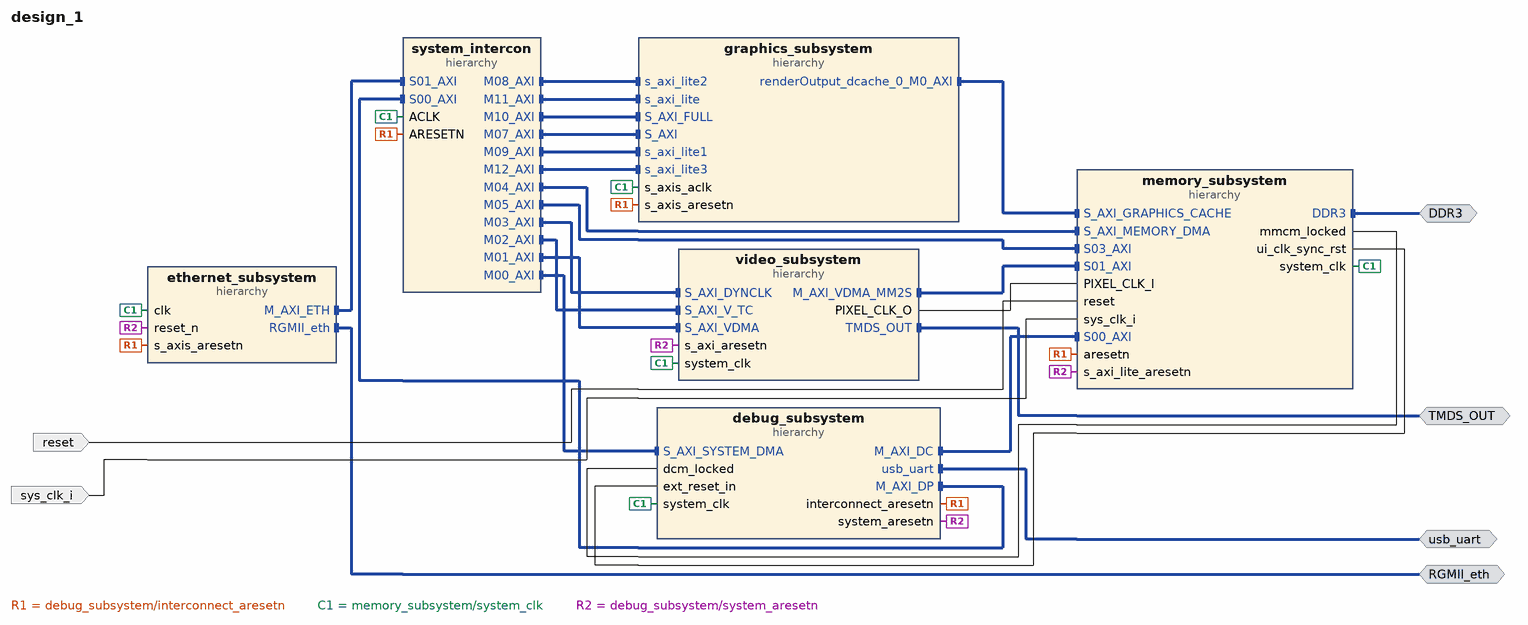
[diagram p0: block diagram of the top level]
# Vivado block design design_1, xc7a200tsbg484-1, Vivado 2020.1
create_bd_design design_1

create_bd_intf_port -mode Master -vlnv xilinx.com:interface:ddrx_rtl:1.0 DDR3
create_bd_intf_port -mode Master -vlnv xilinx.com:interface:eth_rtl:1.0 RGMII_eth
create_bd_intf_port -mode Master -vlnv digilentinc.com:interface:tmds_rtl:1.0 TMDS_OUT
create_bd_intf_port -mode Master -vlnv xilinx.com:interface:uart_rtl:1.0 usb_uart
create_bd_port -dir I -type rst reset
create_bd_port -dir I -type clk sys_clk_i
set_property -dict {CONFIG.FREQ_HZ 100000000} [get_bd_ports sys_clk_i]

create_bd_cell -type hier debug_subsystem
create_bd_cell -type hier ethernet_subsystem
create_bd_cell -type hier graphics_subsystem
create_bd_cell -type hier memory_subsystem
create_bd_cell -type hier system_intercon
create_bd_cell -type hier video_subsystem

# ---- hierarchy /debug_subsystem ----
current_bd_instance /debug_subsystem
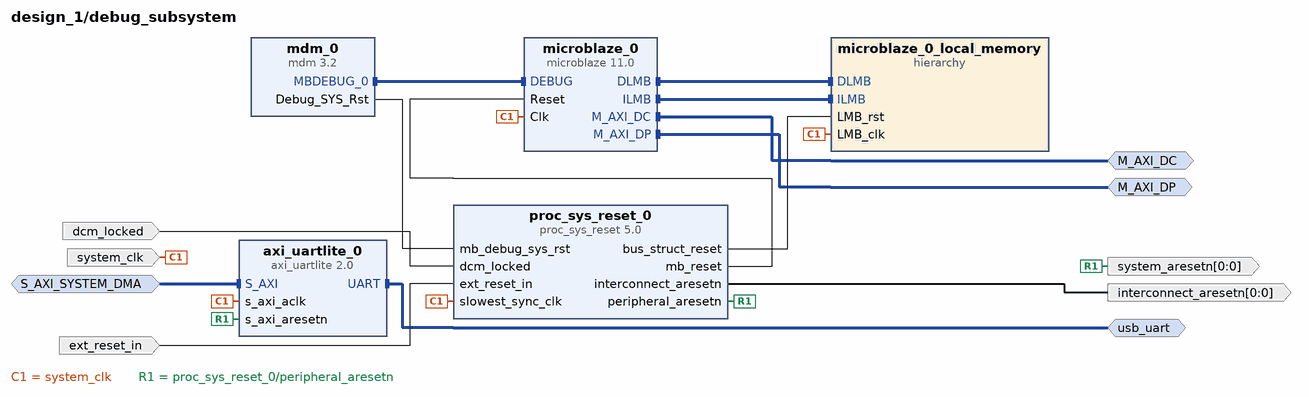
[diagram p1: block diagram inside /debug_subsystem]
create_bd_intf_pin -mode Master -vlnv xilinx.com:interface:aximm_rtl:1.0 M_AXI_DC
create_bd_intf_pin -mode Master -vlnv xilinx.com:interface:aximm_rtl:1.0 M_AXI_DP
create_bd_intf_pin -mode Slave -vlnv xilinx.com:interface:aximm_rtl:1.0 S_AXI_SYSTEM_DMA
create_bd_intf_pin -mode Master -vlnv xilinx.com:interface:uart_rtl:1.0 usb_uart
create_bd_pin -dir I dcm_locked
create_bd_pin -dir I -type rst ext_reset_in
create_bd_pin -dir O -from 0 -to 0 -type rst interconnect_aresetn
create_bd_pin -dir O -from 0 -to 0 -type rst system_aresetn
create_bd_pin -dir I -type clk system_clk

create_bd_cell -type ip -vlnv xilinx.com:ip:axi_uartlite:2.0 axi_uartlite_0
set_property -dict [list \
  CONFIG.C_BAUDRATE 115200 \
  CONFIG.UARTLITE_BOARD_INTERFACE usb_uart \
  CONFIG.USE_BOARD_FLOW true \
] [get_bd_cells axi_uartlite_0]
create_bd_cell -type ip -vlnv xilinx.com:ip:mdm:3.2 mdm_0
create_bd_cell -type ip -vlnv xilinx.com:ip:microblaze:11.0 microblaze_0
set_property -dict [list \
  CONFIG.C_ADDR_TAG_BITS 0 \
  CONFIG.C_DCACHE_ADDR_TAG 16 \
  CONFIG.C_DCACHE_ALWAYS_USED 1 \
  CONFIG.C_DCACHE_BASEADDR 0x0000000080000000 \
  CONFIG.C_DCACHE_DATA_WIDTH 1 \
  CONFIG.C_DCACHE_HIGHADDR 0x000000009FFFFFFF \
  CONFIG.C_DCACHE_USE_WRITEBACK 1 \
  CONFIG.C_DCACHE_VICTIMS 8 \
  CONFIG.C_D_AXI 1 \
  CONFIG.C_FSL_LINKS 1 \
  CONFIG.C_USE_DCACHE 1 \
  CONFIG.C_USE_EXTENDED_FSL_INSTR 1 \
  CONFIG.C_USE_ICACHE 0 \
  CONFIG.C_USE_MSR_INSTR 1 \
  CONFIG.C_USE_REORDER_INSTR 0 \
] [get_bd_cells microblaze_0]
create_bd_cell -type hier microblaze_0_local_memory
create_bd_cell -type ip -vlnv xilinx.com:ip:proc_sys_reset:5.0 proc_sys_reset_0

# ---- hierarchy /debug_subsystem/microblaze_0_local_memory ----
current_bd_instance /debug_subsystem/microblaze_0_local_memory
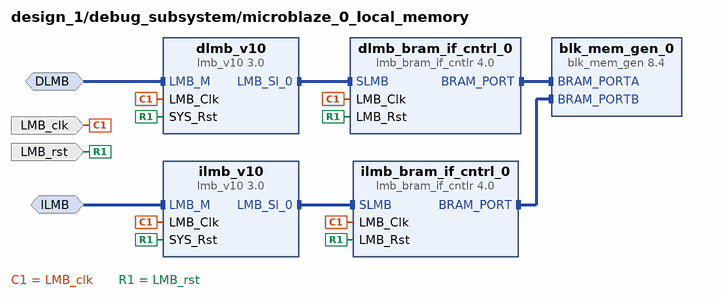
[diagram p2: block diagram inside /debug_subsystem/microblaze_0_local_memory]
create_bd_intf_pin -mode MirroredMaster -vlnv xilinx.com:interface:lmb_rtl:1.0 DLMB
create_bd_intf_pin -mode MirroredMaster -vlnv xilinx.com:interface:lmb_rtl:1.0 ILMB
create_bd_pin -dir I -type clk LMB_clk
create_bd_pin -dir I -type rst LMB_rst

create_bd_cell -type ip -vlnv xilinx.com:ip:blk_mem_gen:8.4 blk_mem_gen_0
set_property -dict [list \
  CONFIG.Assume_Synchronous_Clk false \
  CONFIG.EN_SAFETY_CKT false \
  CONFIG.Enable_32bit_Address true \
  CONFIG.Enable_B Use_ENB_Pin \
  CONFIG.Memory_Type True_Dual_Port_RAM \
  CONFIG.Port_B_Clock 100 \
  CONFIG.Port_B_Enable_Rate 100 \
  CONFIG.Port_B_Write_Rate 50 \
  CONFIG.Register_PortA_Output_of_Memory_Primitives false \
  CONFIG.Register_PortB_Output_of_Memory_Primitives false \
  CONFIG.Use_RSTA_Pin true \
  CONFIG.Use_RSTB_Pin true \
  CONFIG.use_bram_block BRAM_Controller \
] [get_bd_cells blk_mem_gen_0]
create_bd_cell -type ip -vlnv xilinx.com:ip:lmb_bram_if_cntlr:4.0 dlmb_bram_if_cntrl_0
create_bd_cell -type ip -vlnv xilinx.com:ip:lmb_v10:3.0 dlmb_v10
create_bd_cell -type ip -vlnv xilinx.com:ip:lmb_bram_if_cntlr:4.0 ilmb_bram_if_cntrl_0
create_bd_cell -type ip -vlnv xilinx.com:ip:lmb_v10:3.0 ilmb_v10

# ---- hierarchy /ethernet_subsystem ----
current_bd_instance /ethernet_subsystem
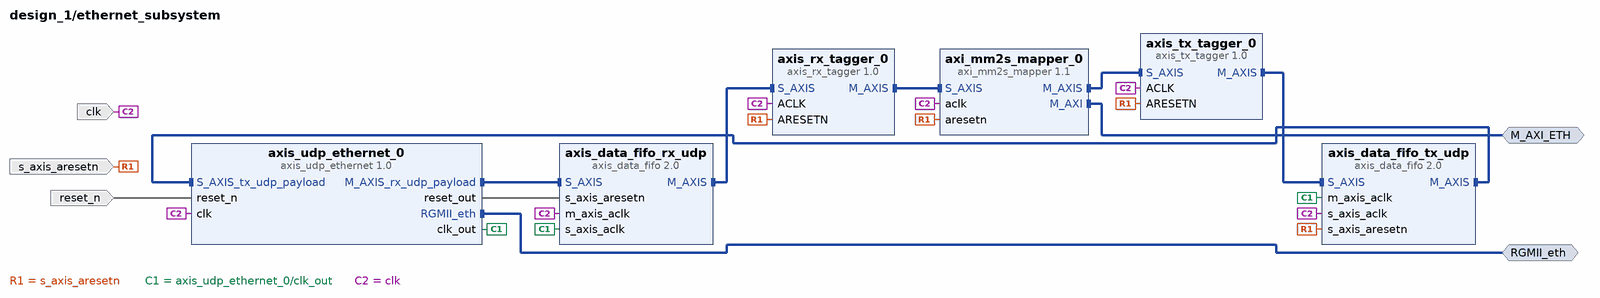
[diagram p3: block diagram inside /ethernet_subsystem]
create_bd_intf_pin -mode Master -vlnv xilinx.com:interface:aximm_rtl:1.0 M_AXI_ETH
create_bd_intf_pin -mode Master -vlnv xilinx.com:interface:eth_rtl:1.0 RGMII_eth
create_bd_pin -dir I -type clk clk
create_bd_pin -dir I -type rst reset_n
create_bd_pin -dir I -type rst s_axis_aresetn

create_bd_cell -type ip -vlnv xilinx.com:ip:axi_mm2s_mapper:1.1 axi_mm2s_mapper_0
set_property -dict {CONFIG.INTERFACES M_AXI} [get_bd_cells axi_mm2s_mapper_0]
create_bd_cell -type ip -vlnv xilinx.com:ip:axis_data_fifo:2.0 axis_data_fifo_rx_udp
set_property -dict {CONFIG.FIFO_DEPTH 2048 CONFIG.IS_ACLK_ASYNC 1} [get_bd_cells axis_data_fifo_rx_udp]
create_bd_cell -type ip -vlnv xilinx.com:ip:axis_data_fifo:2.0 axis_data_fifo_tx_udp
set_property -dict {CONFIG.FIFO_DEPTH 2048 CONFIG.IS_ACLK_ASYNC 1} [get_bd_cells axis_data_fifo_tx_udp]
create_bd_cell -type ip -vlnv xilinx.com:user:axis_rx_tagger:1.0 axis_rx_tagger_0
create_bd_cell -type ip -vlnv xilinx.com:user:axis_tx_tagger:1.0 axis_tx_tagger_0
create_bd_cell -type ip -vlnv xilinx.com:ip:axis_udp_ethernet:1.0 axis_udp_ethernet_0

# ---- hierarchy /graphics_subsystem ----
current_bd_instance /graphics_subsystem
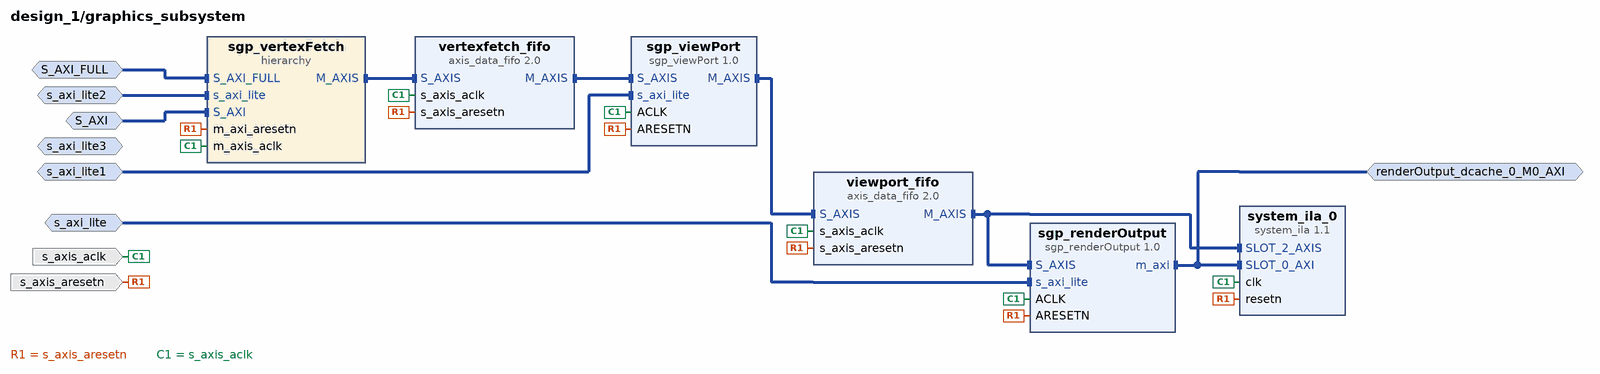
[diagram p4: block diagram inside /graphics_subsystem]
create_bd_intf_pin -mode Slave -vlnv xilinx.com:interface:aximm_rtl:1.0 S_AXI
create_bd_intf_pin -mode Slave -vlnv xilinx.com:interface:aximm_rtl:1.0 S_AXI_FULL
create_bd_intf_pin -mode Master -vlnv xilinx.com:interface:aximm_rtl:1.0 renderOutput_dcache_0_M0_AXI
create_bd_intf_pin -mode Slave -vlnv xilinx.com:interface:aximm_rtl:1.0 s_axi_lite
create_bd_intf_pin -mode Slave -vlnv xilinx.com:interface:aximm_rtl:1.0 s_axi_lite1
create_bd_intf_pin -mode Slave -vlnv xilinx.com:interface:aximm_rtl:1.0 s_axi_lite2
create_bd_intf_pin -mode Slave -vlnv xilinx.com:interface:aximm_rtl:1.0 s_axi_lite3
create_bd_pin -dir I -type clk s_axis_aclk
create_bd_pin -dir I -type rst s_axis_aresetn

create_bd_cell -type ip -vlnv xilinx.com:user:sgp_renderOutput:1.0 sgp_renderOutput
set_property -dict {CONFIG.C_M_AXI_ID_WIDTH 4} [get_bd_cells sgp_renderOutput]
create_bd_cell -type hier sgp_vertexFetch
create_bd_cell -type ip -vlnv xilinx.com:user:sgp_viewPort:1.0 sgp_viewPort
create_bd_cell -type ip -vlnv xilinx.com:ip:system_ila:1.1 system_ila_0
set_property -dict [list \
  CONFIG.C_NUM_MONITOR_SLOTS 3 \
  CONFIG.C_SLOT 2 \
  CONFIG.C_SLOT_1_INTF_TYPE xilinx.com:interface:axis_rtl:1.0 \
  CONFIG.C_SLOT_2_INTF_TYPE xilinx.com:interface:axis_rtl:1.0 \
] [get_bd_cells system_ila_0]
create_bd_cell -type ip -vlnv xilinx.com:ip:axis_data_fifo:2.0 vertexfetch_fifo
set_property -dict {CONFIG.FIFO_DEPTH 16} [get_bd_cells vertexfetch_fifo]
create_bd_cell -type ip -vlnv xilinx.com:ip:axis_data_fifo:2.0 viewport_fifo

# ---- hierarchy /graphics_subsystem/sgp_vertexFetch ----
current_bd_instance /graphics_subsystem/sgp_vertexFetch
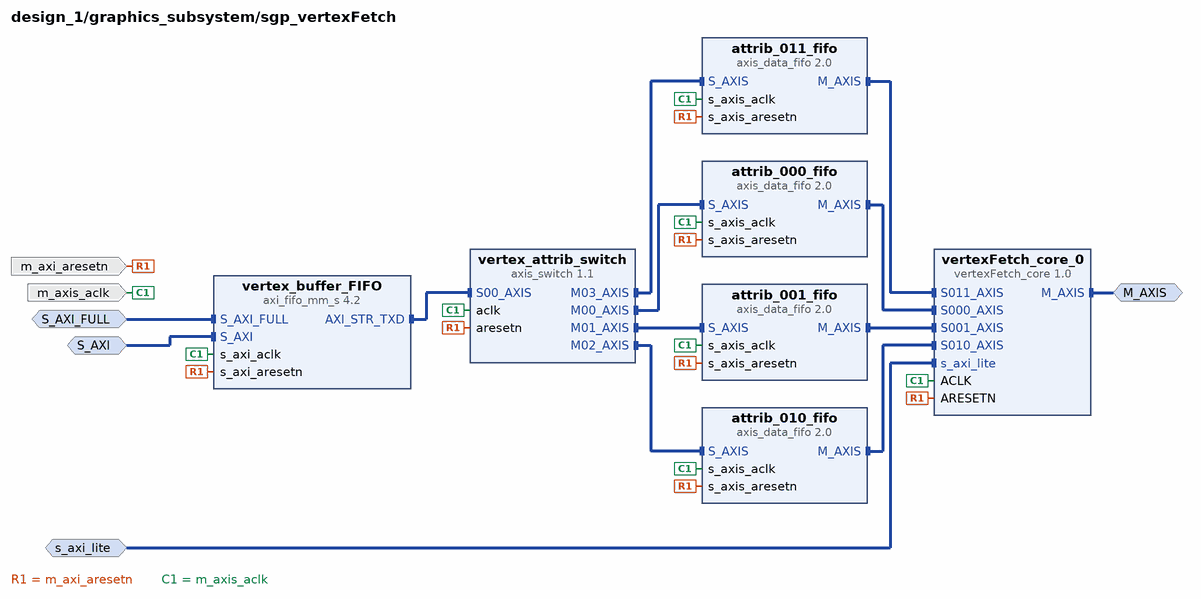
[diagram p5: block diagram inside /graphics_subsystem/sgp_vertexFetch]
create_bd_intf_pin -mode Master -vlnv xilinx.com:interface:axis_rtl:1.0 M_AXIS
create_bd_intf_pin -mode Slave -vlnv xilinx.com:interface:aximm_rtl:1.0 S_AXI
create_bd_intf_pin -mode Slave -vlnv xilinx.com:interface:aximm_rtl:1.0 S_AXI_FULL
create_bd_intf_pin -mode Slave -vlnv xilinx.com:interface:aximm_rtl:1.0 s_axi_lite
create_bd_pin -dir I -type rst m_axi_aresetn
create_bd_pin -dir I -type clk m_axis_aclk

create_bd_cell -type ip -vlnv xilinx.com:ip:axis_data_fifo:2.0 attrib_000_fifo
set_property -dict {CONFIG.FIFO_DEPTH 1024} [get_bd_cells attrib_000_fifo]
create_bd_cell -type ip -vlnv xilinx.com:ip:axis_data_fifo:2.0 attrib_001_fifo
set_property -dict {CONFIG.FIFO_DEPTH 1024} [get_bd_cells attrib_001_fifo]
create_bd_cell -type ip -vlnv xilinx.com:ip:axis_data_fifo:2.0 attrib_010_fifo
set_property -dict {CONFIG.FIFO_DEPTH 1024} [get_bd_cells attrib_010_fifo]
create_bd_cell -type ip -vlnv xilinx.com:ip:axis_data_fifo:2.0 attrib_011_fifo
set_property -dict {CONFIG.FIFO_DEPTH 1024} [get_bd_cells attrib_011_fifo]
create_bd_cell -type ip -vlnv xilinx.com:user:vertexFetch_core:1.0 vertexFetch_core_0
create_bd_cell -type ip -vlnv xilinx.com:ip:axis_switch:1.1 vertex_attrib_switch
set_property -dict [list \
  CONFIG.DECODER_REG 1 \
  CONFIG.NUM_MI 4 \
  CONFIG.NUM_SI 1 \
  CONFIG.ROUTING_MODE 0 \
] [get_bd_cells vertex_attrib_switch]
create_bd_cell -type ip -vlnv xilinx.com:ip:axi_fifo_mm_s:4.2 vertex_buffer_FIFO
set_property -dict [list \
  CONFIG.C_DATA_INTERFACE_TYPE 1 \
  CONFIG.C_HAS_AXIS_TDEST true \
  CONFIG.C_TX_FIFO_DEPTH 4096 \
  CONFIG.C_TX_FIFO_PE_THRESHOLD 5 \
  CONFIG.C_TX_FIFO_PF_THRESHOLD 507 \
  CONFIG.C_USE_RX_DATA 0 \
  CONFIG.C_USE_TX_CTRL 0 \
] [get_bd_cells vertex_buffer_FIFO]

# ---- hierarchy /memory_subsystem ----
current_bd_instance /memory_subsystem
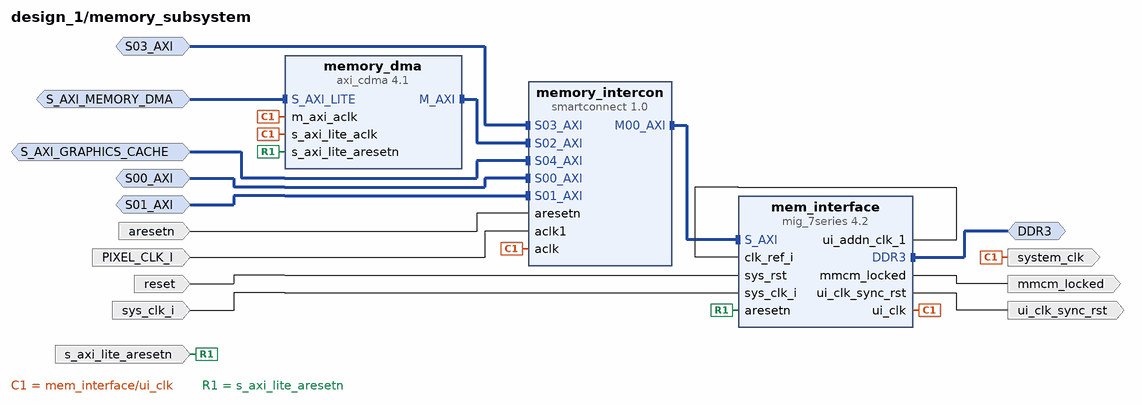
[diagram p6: block diagram inside /memory_subsystem]
create_bd_intf_pin -mode Master -vlnv xilinx.com:interface:ddrx_rtl:1.0 DDR3
create_bd_intf_pin -mode Slave -vlnv xilinx.com:interface:aximm_rtl:1.0 S00_AXI
create_bd_intf_pin -mode Slave -vlnv xilinx.com:interface:aximm_rtl:1.0 S01_AXI
create_bd_intf_pin -mode Slave -vlnv xilinx.com:interface:aximm_rtl:1.0 S03_AXI
create_bd_intf_pin -mode Slave -vlnv xilinx.com:interface:aximm_rtl:1.0 S_AXI_GRAPHICS_CACHE
create_bd_intf_pin -mode Slave -vlnv xilinx.com:interface:aximm_rtl:1.0 S_AXI_MEMORY_DMA
create_bd_pin -dir I -type clk PIXEL_CLK_I
create_bd_pin -dir I -type rst aresetn
create_bd_pin -dir O mmcm_locked
create_bd_pin -dir I -type rst reset
create_bd_pin -dir I -type rst s_axi_lite_aresetn
create_bd_pin -dir I -type clk sys_clk_i
create_bd_pin -dir O -type clk system_clk
create_bd_pin -dir O -type rst ui_clk_sync_rst

create_bd_cell -type ip -vlnv xilinx.com:ip:mig_7series:4.2 mem_interface
set_property -dict [list \
  CONFIG.BOARD_MIG_PARAM Custom \
  CONFIG.MIG_DONT_TOUCH_PARAM Custom \
  CONFIG.RESET_BOARD_INTERFACE Custom \
  CONFIG.XML_INPUT_FILE mig_b.prj \
] [get_bd_cells mem_interface]
create_bd_cell -type ip -vlnv xilinx.com:ip:axi_cdma:4.1 memory_dma
set_property -dict [list \
  CONFIG.C_INCLUDE_DRE 1 \
  CONFIG.C_INCLUDE_SF 1 \
  CONFIG.C_INCLUDE_SG 0 \
  CONFIG.C_M_AXI_DATA_WIDTH 32 \
  CONFIG.C_M_AXI_MAX_BURST_LEN 16 \
] [get_bd_cells memory_dma]
create_bd_cell -type ip -vlnv xilinx.com:ip:smartconnect:1.0 memory_intercon
set_property -dict [list \
  CONFIG.ADVANCED_PROPERTIES {  __view__ { clocking { S03_Entry { ASSOCIATED_CLK aclk } } } } \
  CONFIG.NUM_CLKS 2 \
  CONFIG.NUM_SI 5 \
] [get_bd_cells memory_intercon]

# ---- hierarchy /system_intercon ----
current_bd_instance /system_intercon
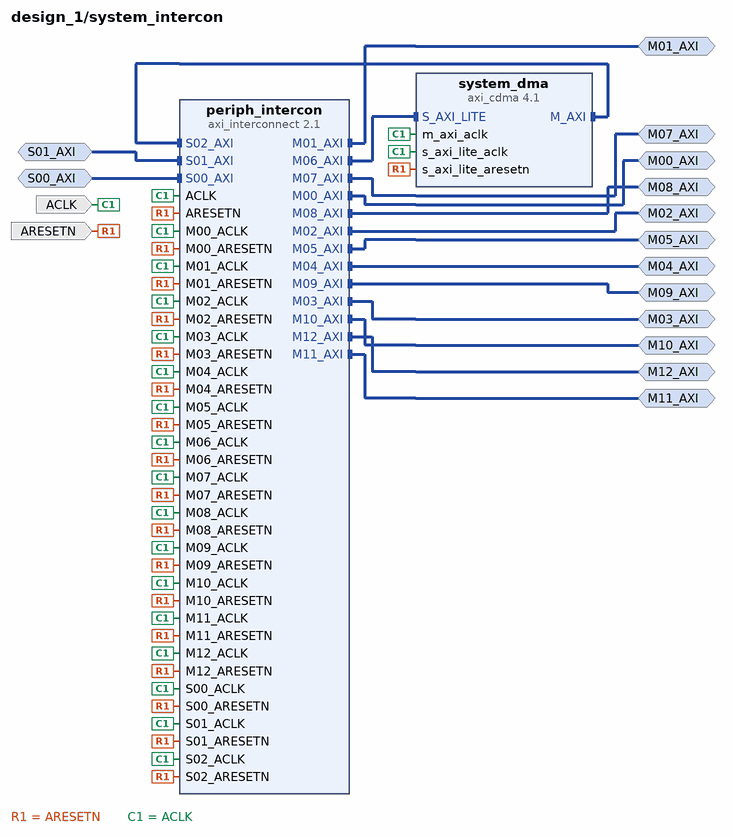
[diagram p7: block diagram inside /system_intercon]
create_bd_intf_pin -mode Master -vlnv xilinx.com:interface:aximm_rtl:1.0 M00_AXI
create_bd_intf_pin -mode Master -vlnv xilinx.com:interface:aximm_rtl:1.0 M01_AXI
create_bd_intf_pin -mode Master -vlnv xilinx.com:interface:aximm_rtl:1.0 M02_AXI
create_bd_intf_pin -mode Master -vlnv xilinx.com:interface:aximm_rtl:1.0 M03_AXI
create_bd_intf_pin -mode Master -vlnv xilinx.com:interface:aximm_rtl:1.0 M04_AXI
create_bd_intf_pin -mode Master -vlnv xilinx.com:interface:aximm_rtl:1.0 M05_AXI
create_bd_intf_pin -mode Master -vlnv xilinx.com:interface:aximm_rtl:1.0 M07_AXI
create_bd_intf_pin -mode Master -vlnv xilinx.com:interface:aximm_rtl:1.0 M08_AXI
create_bd_intf_pin -mode Master -vlnv xilinx.com:interface:aximm_rtl:1.0 M09_AXI
create_bd_intf_pin -mode Master -vlnv xilinx.com:interface:aximm_rtl:1.0 M10_AXI
create_bd_intf_pin -mode Master -vlnv xilinx.com:interface:aximm_rtl:1.0 M11_AXI
create_bd_intf_pin -mode Master -vlnv xilinx.com:interface:aximm_rtl:1.0 M12_AXI
create_bd_intf_pin -mode Slave -vlnv xilinx.com:interface:aximm_rtl:1.0 S00_AXI
create_bd_intf_pin -mode Slave -vlnv xilinx.com:interface:aximm_rtl:1.0 S01_AXI
create_bd_pin -dir I -type clk ACLK
create_bd_pin -dir I -type rst ARESETN

create_bd_cell -type ip -vlnv xilinx.com:ip:axi_interconnect:2.1 periph_intercon
set_property -dict {CONFIG.ENABLE_ADVANCED_OPTIONS 1 CONFIG.NUM_MI 13 CONFIG.NUM_SI 3} [get_bd_cells periph_intercon]
create_bd_cell -type ip -vlnv xilinx.com:ip:axi_cdma:4.1 system_dma
set_property -dict {CONFIG.C_INCLUDE_DRE 1 CONFIG.C_INCLUDE_SF 1 CONFIG.C_INCLUDE_SG 0} [get_bd_cells system_dma]

# ---- hierarchy /video_subsystem ----
current_bd_instance /video_subsystem
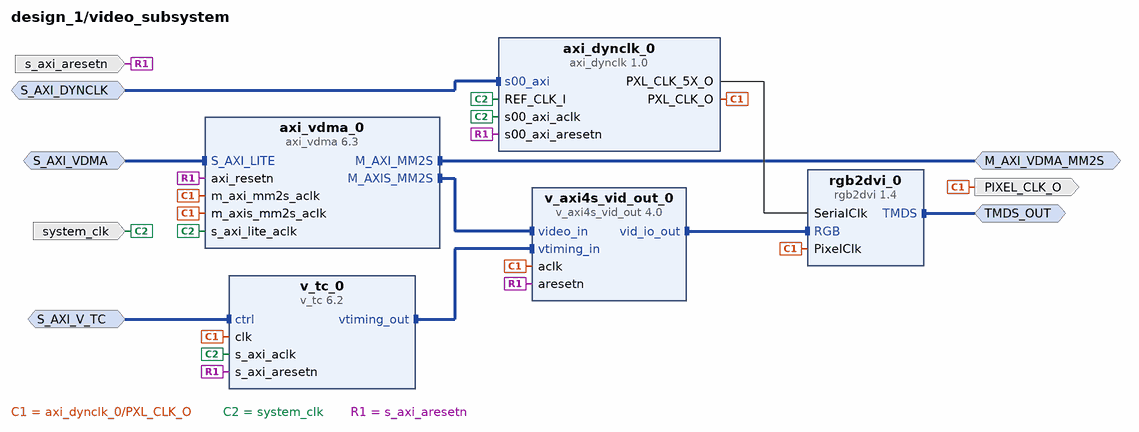
[diagram p8: block diagram inside /video_subsystem]
create_bd_intf_pin -mode Master -vlnv xilinx.com:interface:aximm_rtl:1.0 M_AXI_VDMA_MM2S
create_bd_intf_pin -mode Slave -vlnv xilinx.com:interface:aximm_rtl:1.0 S_AXI_DYNCLK
create_bd_intf_pin -mode Slave -vlnv xilinx.com:interface:aximm_rtl:1.0 S_AXI_VDMA
create_bd_intf_pin -mode Slave -vlnv xilinx.com:interface:aximm_rtl:1.0 S_AXI_V_TC
create_bd_intf_pin -mode Master -vlnv digilentinc.com:interface:tmds_rtl:1.0 TMDS_OUT
create_bd_pin -dir O -type clk PIXEL_CLK_O
create_bd_pin -dir I -type rst s_axi_aresetn
create_bd_pin -dir I -type clk system_clk

create_bd_cell -type ip -vlnv digilentinc.com:ip:axi_dynclk:1.0 axi_dynclk_0
set_property -dict {CONFIG.ADD_BUFMR true} [get_bd_cells axi_dynclk_0]
create_bd_cell -type ip -vlnv xilinx.com:ip:axi_vdma:6.3 axi_vdma_0
set_property -dict [list \
  CONFIG.c_include_s2mm 0 \
  CONFIG.c_m_axi_mm2s_data_width 128 \
  CONFIG.c_m_axis_mm2s_tdata_width 32 \
  CONFIG.c_mm2s_genlock_mode 0 \
  CONFIG.c_mm2s_linebuffer_depth 512 \
  CONFIG.c_mm2s_max_burst_length 32 \
] [get_bd_cells axi_vdma_0]
create_bd_cell -type ip -vlnv digilentinc.com:ip:rgb2dvi:1.4 rgb2dvi_0
set_property -dict {CONFIG.kGenerateSerialClk false CONFIG.kRstActiveHigh false} [get_bd_cells rgb2dvi_0]
create_bd_cell -type ip -vlnv xilinx.com:ip:v_axi4s_vid_out:4.0 v_axi4s_vid_out_0
set_property -dict [list \
  CONFIG.C_ADDR_WIDTH 5 \
  CONFIG.C_S_AXIS_VIDEO_DATA_WIDTH 8 \
  CONFIG.C_S_AXIS_VIDEO_FORMAT 6 \
  CONFIG.C_VTG_MASTER_SLAVE 1 \
] [get_bd_cells v_axi4s_vid_out_0]
create_bd_cell -type ip -vlnv xilinx.com:ip:v_tc:6.2 v_tc_0
set_property -dict {CONFIG.VIDEO_MODE 1080p CONFIG.enable_detection false} [get_bd_cells v_tc_0]

# ---- connections ----

current_bd_instance /debug_subsystem
connect_bd_intf_net [get_bd_intf_pins usb_uart] [get_bd_intf_pins axi_uartlite_0/UART]
connect_bd_intf_net [get_bd_intf_pins M_AXI_DC] [get_bd_intf_pins microblaze_0/M_AXI_DC]
connect_bd_intf_net [get_bd_intf_pins mdm_0/MBDEBUG_0] [get_bd_intf_pins microblaze_0/DEBUG]
connect_bd_intf_net [get_bd_intf_pins microblaze_0/DLMB] [get_bd_intf_pins microblaze_0_local_memory/DLMB]
connect_bd_intf_net [get_bd_intf_pins microblaze_0/ILMB] [get_bd_intf_pins microblaze_0_local_memory/ILMB]
connect_bd_intf_net -intf_net axi_interconnect_0_M00_AXI [get_bd_intf_pins S_AXI_SYSTEM_DMA] [get_bd_intf_pins axi_uartlite_0/S_AXI]
connect_bd_intf_net [get_bd_intf_pins M_AXI_DP] [get_bd_intf_pins microblaze_0/M_AXI_DP]
connect_bd_net -net ARESETN_1 [get_bd_pins proc_sys_reset_0/interconnect_aresetn] [get_bd_pins interconnect_aresetn]
connect_bd_net [get_bd_pins mdm_0/Debug_SYS_Rst] [get_bd_pins proc_sys_reset_0/mb_debug_sys_rst]
connect_bd_net -net mem_interface_mmcm_locked [get_bd_pins dcm_locked] [get_bd_pins proc_sys_reset_0/dcm_locked]
connect_bd_net -net mem_interface_ui_clk [get_bd_pins system_clk] \
  [get_bd_pins axi_uartlite_0/s_axi_aclk] [get_bd_pins microblaze_0/Clk] [get_bd_pins microblaze_0_local_memory/LMB_clk] \
  [get_bd_pins proc_sys_reset_0/slowest_sync_clk]
connect_bd_net -net mem_interface_ui_clk_sync_rst [get_bd_pins ext_reset_in] [get_bd_pins proc_sys_reset_0/ext_reset_in]
connect_bd_net [get_bd_pins proc_sys_reset_0/bus_struct_reset] [get_bd_pins microblaze_0_local_memory/LMB_rst]
connect_bd_net [get_bd_pins proc_sys_reset_0/mb_reset] [get_bd_pins microblaze_0/Reset]
connect_bd_net [get_bd_pins proc_sys_reset_0/peripheral_aresetn] [get_bd_pins system_aresetn] [get_bd_pins axi_uartlite_0/s_axi_aresetn]
set_property HDL_ATTRIBUTE.BMM_INFO_PROCESSOR {microblaze-le > design_1 debug_subsystem/microblaze_0_local_memory/dlmb_bram_if_cntrl_0} [get_bd_cells microblaze_0]
set_property HDL_ATTRIBUTE.KEEP_HIERARCHY yes [get_bd_cells microblaze_0]

current_bd_instance /debug_subsystem/microblaze_0_local_memory
connect_bd_intf_net -intf_net microblaze_0_DLMB [get_bd_intf_pins DLMB] [get_bd_intf_pins dlmb_v10/LMB_M]
connect_bd_intf_net [get_bd_intf_pins dlmb_bram_if_cntrl_0/SLMB] [get_bd_intf_pins dlmb_v10/LMB_Sl_0]
connect_bd_intf_net [get_bd_intf_pins ilmb_bram_if_cntrl_0/SLMB] [get_bd_intf_pins ilmb_v10/LMB_Sl_0]
connect_bd_intf_net -intf_net microblaze_0_ILMB [get_bd_intf_pins ILMB] [get_bd_intf_pins ilmb_v10/LMB_M]
connect_bd_intf_net [get_bd_intf_pins blk_mem_gen_0/BRAM_PORTA] [get_bd_intf_pins dlmb_bram_if_cntrl_0/BRAM_PORT]
connect_bd_intf_net [get_bd_intf_pins blk_mem_gen_0/BRAM_PORTB] [get_bd_intf_pins ilmb_bram_if_cntrl_0/BRAM_PORT]
connect_bd_net [get_bd_pins LMB_clk] \
  [get_bd_pins dlmb_bram_if_cntrl_0/LMB_Clk] [get_bd_pins dlmb_v10/LMB_Clk] [get_bd_pins ilmb_bram_if_cntrl_0/LMB_Clk] \
  [get_bd_pins ilmb_v10/LMB_Clk]
connect_bd_net [get_bd_pins LMB_rst] \
  [get_bd_pins dlmb_bram_if_cntrl_0/LMB_Rst] [get_bd_pins dlmb_v10/SYS_Rst] [get_bd_pins ilmb_bram_if_cntrl_0/LMB_Rst] \
  [get_bd_pins ilmb_v10/SYS_Rst]
set_property HDL_ATTRIBUTE.BMM_INFO_ADDRESS_SPACE {byte  0x00000000 32 > design_1 debug_subsystem/microblaze_0_local_memory/blk_mem_gen_0} [get_bd_cells dlmb_bram_if_cntrl_0]
set_property HDL_ATTRIBUTE.KEEP_HIERARCHY yes [get_bd_cells dlmb_bram_if_cntrl_0]

current_bd_instance /ethernet_subsystem
connect_bd_intf_net -intf_net axi_tagger_0_M_AXIS [get_bd_intf_pins axi_mm2s_mapper_0/S_AXIS] [get_bd_intf_pins axis_rx_tagger_0/M_AXIS]
connect_bd_intf_net [get_bd_intf_pins RGMII_eth] [get_bd_intf_pins axis_udp_ethernet_0/RGMII_eth]
connect_bd_intf_net [get_bd_intf_pins M_AXI_ETH] [get_bd_intf_pins axi_mm2s_mapper_0/M_AXI]
connect_bd_intf_net [get_bd_intf_pins axi_mm2s_mapper_0/M_AXIS] [get_bd_intf_pins axis_tx_tagger_0/S_AXIS]
connect_bd_intf_net [get_bd_intf_pins axis_data_fifo_rx_udp/S_AXIS] [get_bd_intf_pins axis_udp_ethernet_0/M_AXIS_rx_udp_payload]
connect_bd_intf_net -intf_net axis_data_fifo_2_M_AXIS [get_bd_intf_pins axis_data_fifo_rx_udp/M_AXIS] [get_bd_intf_pins axis_rx_tagger_0/S_AXIS]
connect_bd_intf_net -intf_net axis_data_fifo_3_M_AXIS [get_bd_intf_pins axis_data_fifo_tx_udp/M_AXIS] [get_bd_intf_pins axis_udp_ethernet_0/S_AXIS_tx_udp_payload]
connect_bd_intf_net [get_bd_intf_pins axis_data_fifo_tx_udp/S_AXIS] [get_bd_intf_pins axis_tx_tagger_0/M_AXIS]
connect_bd_net -net ARESETN_1 [get_bd_pins s_axis_aresetn] \
  [get_bd_pins axi_mm2s_mapper_0/aresetn] [get_bd_pins axis_data_fifo_tx_udp/s_axis_aresetn] \
  [get_bd_pins axis_rx_tagger_0/ARESETN] [get_bd_pins axis_tx_tagger_0/ARESETN]
connect_bd_net [get_bd_pins axis_udp_ethernet_0/clk_out] \
  [get_bd_pins axis_data_fifo_rx_udp/s_axis_aclk] [get_bd_pins axis_data_fifo_tx_udp/m_axis_aclk]
connect_bd_net [get_bd_pins axis_udp_ethernet_0/reset_out] [get_bd_pins axis_data_fifo_rx_udp/s_axis_aresetn]
connect_bd_net -net mem_interface_ui_clk [get_bd_pins clk] \
  [get_bd_pins axi_mm2s_mapper_0/aclk] [get_bd_pins axis_data_fifo_rx_udp/m_axis_aclk] \
  [get_bd_pins axis_data_fifo_tx_udp/s_axis_aclk] [get_bd_pins axis_rx_tagger_0/ACLK] [get_bd_pins axis_tx_tagger_0/ACLK] \
  [get_bd_pins axis_udp_ethernet_0/clk]
connect_bd_net -net proc_sys_reset_0_peripheral_aresetn [get_bd_pins reset_n] [get_bd_pins axis_udp_ethernet_0/reset_n]

current_bd_instance /graphics_subsystem
connect_bd_intf_net -intf_net system_intercon_M10_AXI [get_bd_intf_pins S_AXI_FULL] [get_bd_intf_pins sgp_vertexFetch/S_AXI_FULL]
connect_bd_intf_net -intf_net system_intercon_M11_AXI [get_bd_intf_pins s_axi_lite] [get_bd_intf_pins sgp_renderOutput/s_axi_lite]
connect_bd_intf_net -intf_net vertexFetch_core_0_M_AXIS [get_bd_intf_pins sgp_vertexFetch/M_AXIS] [get_bd_intf_pins vertexfetch_fifo/S_AXIS]
connect_bd_intf_net [get_bd_intf_pins sgp_renderOutput/S_AXIS] [get_bd_intf_pins viewport_fifo/M_AXIS]
connect_bd_intf_net [get_bd_intf_pins sgp_renderOutput/S_AXIS] [get_bd_intf_pins system_ila_0/SLOT_2_AXIS]
connect_bd_intf_net [get_bd_intf_pins sgp_viewPort/S_AXIS] [get_bd_intf_pins vertexfetch_fifo/M_AXIS]
connect_bd_intf_net [get_bd_intf_pins renderOutput_dcache_0_M0_AXI] [get_bd_intf_pins sgp_renderOutput/m_axi]
connect_bd_intf_net [get_bd_intf_pins renderOutput_dcache_0_M0_AXI] [get_bd_intf_pins system_ila_0/SLOT_0_AXI]
connect_bd_intf_net -intf_net system_intercon_M08_AXI [get_bd_intf_pins s_axi_lite2] [get_bd_intf_pins sgp_vertexFetch/s_axi_lite]
connect_bd_intf_net -intf_net system_intercon_M07_AXI [get_bd_intf_pins S_AXI] [get_bd_intf_pins sgp_vertexFetch/S_AXI]
connect_bd_intf_net -intf_net sgp_viewPort_0_M_AXIS [get_bd_intf_pins sgp_viewPort/M_AXIS] [get_bd_intf_pins viewport_fifo/S_AXIS]
connect_bd_intf_net -intf_net system_intercon_M09_AXI [get_bd_intf_pins s_axi_lite1] [get_bd_intf_pins sgp_viewPort/s_axi_lite]
connect_bd_net -net ARESETN_1 [get_bd_pins s_axis_aresetn] \
  [get_bd_pins sgp_renderOutput/ARESETN] [get_bd_pins sgp_vertexFetch/m_axi_aresetn] [get_bd_pins sgp_viewPort/ARESETN] \
  [get_bd_pins system_ila_0/resetn] [get_bd_pins vertexfetch_fifo/s_axis_aresetn] [get_bd_pins viewport_fifo/s_axis_aresetn]
connect_bd_net -net mem_interface_ui_clk [get_bd_pins s_axis_aclk] \
  [get_bd_pins sgp_renderOutput/ACLK] [get_bd_pins sgp_vertexFetch/m_axis_aclk] [get_bd_pins sgp_viewPort/ACLK] \
  [get_bd_pins system_ila_0/clk] [get_bd_pins vertexfetch_fifo/s_axis_aclk] [get_bd_pins viewport_fifo/s_axis_aclk]

current_bd_instance /graphics_subsystem/sgp_vertexFetch
connect_bd_intf_net [get_bd_intf_pins S_AXI_FULL] [get_bd_intf_pins vertex_buffer_FIFO/S_AXI_FULL]
connect_bd_intf_net -intf_net S_AXI_LITE0_1 [get_bd_intf_pins S_AXI] [get_bd_intf_pins vertex_buffer_FIFO/S_AXI]
connect_bd_intf_net [get_bd_intf_pins attrib_000_fifo/M_AXIS] [get_bd_intf_pins vertexFetch_core_0/S000_AXIS]
connect_bd_intf_net [get_bd_intf_pins attrib_000_fifo/S_AXIS] [get_bd_intf_pins vertex_attrib_switch/M00_AXIS]
connect_bd_intf_net [get_bd_intf_pins attrib_001_fifo/S_AXIS] [get_bd_intf_pins vertex_attrib_switch/M01_AXIS]
connect_bd_intf_net [get_bd_intf_pins attrib_011_fifo/M_AXIS] [get_bd_intf_pins vertexFetch_core_0/S011_AXIS]
connect_bd_intf_net [get_bd_intf_pins attrib_010_fifo/S_AXIS] [get_bd_intf_pins vertex_attrib_switch/M02_AXIS]
connect_bd_intf_net [get_bd_intf_pins attrib_011_fifo/S_AXIS] [get_bd_intf_pins vertex_attrib_switch/M03_AXIS]
connect_bd_intf_net [get_bd_intf_pins vertex_attrib_switch/S00_AXIS] [get_bd_intf_pins vertex_buffer_FIFO/AXI_STR_TXD]
connect_bd_intf_net [get_bd_intf_pins attrib_001_fifo/M_AXIS] [get_bd_intf_pins vertexFetch_core_0/S001_AXIS]
connect_bd_intf_net -intf_net S_AXI_LITE1_1 [get_bd_intf_pins s_axi_lite] [get_bd_intf_pins vertexFetch_core_0/s_axi_lite]
connect_bd_intf_net [get_bd_intf_pins attrib_010_fifo/M_AXIS] [get_bd_intf_pins vertexFetch_core_0/S010_AXIS]
connect_bd_intf_net [get_bd_intf_pins M_AXIS] [get_bd_intf_pins vertexFetch_core_0/M_AXIS]
connect_bd_net -net ARESETN_1 [get_bd_pins m_axi_aresetn] \
  [get_bd_pins attrib_000_fifo/s_axis_aresetn] [get_bd_pins attrib_001_fifo/s_axis_aresetn] \
  [get_bd_pins attrib_010_fifo/s_axis_aresetn] [get_bd_pins attrib_011_fifo/s_axis_aresetn] \
  [get_bd_pins vertexFetch_core_0/ARESETN] [get_bd_pins vertex_attrib_switch/aresetn] \
  [get_bd_pins vertex_buffer_FIFO/s_axi_aresetn]
connect_bd_net -net mem_interface_ui_clk [get_bd_pins m_axis_aclk] \
  [get_bd_pins attrib_000_fifo/s_axis_aclk] [get_bd_pins attrib_001_fifo/s_axis_aclk] \
  [get_bd_pins attrib_010_fifo/s_axis_aclk] [get_bd_pins attrib_011_fifo/s_axis_aclk] [get_bd_pins vertexFetch_core_0/ACLK] \
  [get_bd_pins vertex_attrib_switch/aclk] [get_bd_pins vertex_buffer_FIFO/s_axi_aclk]

current_bd_instance /memory_subsystem
connect_bd_intf_net [get_bd_intf_pins S03_AXI] [get_bd_intf_pins memory_intercon/S03_AXI]
connect_bd_intf_net [get_bd_intf_pins S_AXI_MEMORY_DMA] [get_bd_intf_pins memory_dma/S_AXI_LITE]
connect_bd_intf_net [get_bd_intf_pins S_AXI_GRAPHICS_CACHE] [get_bd_intf_pins memory_intercon/S04_AXI]
connect_bd_intf_net [get_bd_intf_pins mem_interface/S_AXI] [get_bd_intf_pins memory_intercon/M00_AXI]
connect_bd_intf_net -intf_net memory_subsystem_M_AXI [get_bd_intf_pins memory_dma/M_AXI] [get_bd_intf_pins memory_intercon/S02_AXI]
connect_bd_intf_net [get_bd_intf_pins DDR3] [get_bd_intf_pins mem_interface/DDR3]
connect_bd_intf_net -intf_net microblaze_0_M_AXI_DC [get_bd_intf_pins S00_AXI] [get_bd_intf_pins memory_intercon/S00_AXI]
connect_bd_intf_net -intf_net video_subsystem_M_AXI_MM2S [get_bd_intf_pins S01_AXI] [get_bd_intf_pins memory_intercon/S01_AXI]
connect_bd_net [get_bd_pins aresetn] [get_bd_pins memory_intercon/aresetn]
connect_bd_net -net aclk1_1 [get_bd_pins PIXEL_CLK_I] [get_bd_pins memory_intercon/aclk1]
connect_bd_net [get_bd_pins mem_interface/mmcm_locked] [get_bd_pins mmcm_locked]
connect_bd_net [get_bd_pins mem_interface/ui_addn_clk_1] [get_bd_pins mem_interface/clk_ref_i]
connect_bd_net [get_bd_pins mem_interface/ui_clk] \
  [get_bd_pins system_clk] [get_bd_pins memory_dma/m_axi_aclk] [get_bd_pins memory_dma/s_axi_lite_aclk] \
  [get_bd_pins memory_intercon/aclk]
connect_bd_net [get_bd_pins mem_interface/ui_clk_sync_rst] [get_bd_pins ui_clk_sync_rst]
connect_bd_net -net proc_sys_reset_0_peripheral_aresetn [get_bd_pins s_axi_lite_aresetn] \
  [get_bd_pins mem_interface/aresetn] [get_bd_pins memory_dma/s_axi_lite_aresetn]
connect_bd_net [get_bd_pins reset] [get_bd_pins mem_interface/sys_rst]
connect_bd_net [get_bd_pins sys_clk_i] [get_bd_pins mem_interface/sys_clk_i]

current_bd_instance /system_intercon
connect_bd_intf_net [get_bd_intf_pins M08_AXI] [get_bd_intf_pins periph_intercon/M08_AXI]
connect_bd_intf_net [get_bd_intf_pins M07_AXI] [get_bd_intf_pins periph_intercon/M07_AXI]
connect_bd_intf_net [get_bd_intf_pins M09_AXI] [get_bd_intf_pins periph_intercon/M09_AXI]
connect_bd_intf_net -intf_net S03_AXI_1 [get_bd_intf_pins M05_AXI] [get_bd_intf_pins periph_intercon/M05_AXI]
connect_bd_intf_net -intf_net S_AXI_LITE_1 [get_bd_intf_pins M01_AXI] [get_bd_intf_pins periph_intercon/M01_AXI]
connect_bd_intf_net -intf_net S_AXI_LITE_2 [get_bd_intf_pins M04_AXI] [get_bd_intf_pins periph_intercon/M04_AXI]
connect_bd_intf_net -intf_net axi_interconnect_0_M00_AXI [get_bd_intf_pins M00_AXI] [get_bd_intf_pins periph_intercon/M00_AXI]
connect_bd_intf_net -intf_net ctrl_1 [get_bd_intf_pins M02_AXI] [get_bd_intf_pins periph_intercon/M02_AXI]
connect_bd_intf_net -intf_net ethernet_subsystem_M00_AXI [get_bd_intf_pins S01_AXI] [get_bd_intf_pins periph_intercon/S01_AXI]
connect_bd_intf_net -intf_net microblaze_0_M_AXI_DP [get_bd_intf_pins S00_AXI] [get_bd_intf_pins periph_intercon/S00_AXI]
connect_bd_intf_net [get_bd_intf_pins M12_AXI] [get_bd_intf_pins periph_intercon/M12_AXI]
connect_bd_intf_net [get_bd_intf_pins M10_AXI] [get_bd_intf_pins periph_intercon/M10_AXI]
connect_bd_intf_net -intf_net s00_axi_1 [get_bd_intf_pins M03_AXI] [get_bd_intf_pins periph_intercon/M03_AXI]
connect_bd_intf_net [get_bd_intf_pins M11_AXI] [get_bd_intf_pins periph_intercon/M11_AXI]
connect_bd_intf_net [get_bd_intf_pins periph_intercon/M06_AXI] [get_bd_intf_pins system_dma/S_AXI_LITE]
connect_bd_intf_net [get_bd_intf_pins periph_intercon/S02_AXI] [get_bd_intf_pins system_dma/M_AXI]
connect_bd_net [get_bd_pins ARESETN] \
  [get_bd_pins periph_intercon/ARESETN] [get_bd_pins periph_intercon/M00_ARESETN] [get_bd_pins periph_intercon/M01_ARESETN] \
  [get_bd_pins periph_intercon/M02_ARESETN] [get_bd_pins periph_intercon/M03_ARESETN] \
  [get_bd_pins periph_intercon/M04_ARESETN] [get_bd_pins periph_intercon/M05_ARESETN] \
  [get_bd_pins periph_intercon/M06_ARESETN] [get_bd_pins periph_intercon/M07_ARESETN] \
  [get_bd_pins periph_intercon/M08_ARESETN] [get_bd_pins periph_intercon/M09_ARESETN] \
  [get_bd_pins periph_intercon/M10_ARESETN] [get_bd_pins periph_intercon/M11_ARESETN] \
  [get_bd_pins periph_intercon/M12_ARESETN] [get_bd_pins periph_intercon/S00_ARESETN] \
  [get_bd_pins periph_intercon/S01_ARESETN] [get_bd_pins periph_intercon/S02_ARESETN] \
  [get_bd_pins system_dma/s_axi_lite_aresetn]
connect_bd_net -net mem_interface_ui_clk [get_bd_pins ACLK] \
  [get_bd_pins periph_intercon/ACLK] [get_bd_pins periph_intercon/M00_ACLK] [get_bd_pins periph_intercon/M01_ACLK] \
  [get_bd_pins periph_intercon/M02_ACLK] [get_bd_pins periph_intercon/M03_ACLK] [get_bd_pins periph_intercon/M04_ACLK] \
  [get_bd_pins periph_intercon/M05_ACLK] [get_bd_pins periph_intercon/M06_ACLK] [get_bd_pins periph_intercon/M07_ACLK] \
  [get_bd_pins periph_intercon/M08_ACLK] [get_bd_pins periph_intercon/M09_ACLK] [get_bd_pins periph_intercon/M10_ACLK] \
  [get_bd_pins periph_intercon/M11_ACLK] [get_bd_pins periph_intercon/M12_ACLK] [get_bd_pins periph_intercon/S00_ACLK] \
  [get_bd_pins periph_intercon/S01_ACLK] [get_bd_pins periph_intercon/S02_ACLK] [get_bd_pins system_dma/m_axi_aclk] \
  [get_bd_pins system_dma/s_axi_lite_aclk]

current_bd_instance /video_subsystem
connect_bd_intf_net [get_bd_intf_pins axi_vdma_0/M_AXIS_MM2S] [get_bd_intf_pins v_axi4s_vid_out_0/video_in]
connect_bd_intf_net [get_bd_intf_pins TMDS_OUT] [get_bd_intf_pins rgb2dvi_0/TMDS]
connect_bd_intf_net -intf_net periph_intercon_M01_AXI [get_bd_intf_pins S_AXI_VDMA] [get_bd_intf_pins axi_vdma_0/S_AXI_LITE]
connect_bd_intf_net [get_bd_intf_pins M_AXI_VDMA_MM2S] [get_bd_intf_pins axi_vdma_0/M_AXI_MM2S]
connect_bd_intf_net -intf_net periph_intercon_M02_AXI [get_bd_intf_pins S_AXI_V_TC] [get_bd_intf_pins v_tc_0/ctrl]
connect_bd_intf_net -intf_net periph_intercon_M03_AXI [get_bd_intf_pins S_AXI_DYNCLK] [get_bd_intf_pins axi_dynclk_0/s00_axi]
connect_bd_intf_net [get_bd_intf_pins rgb2dvi_0/RGB] [get_bd_intf_pins v_axi4s_vid_out_0/vid_io_out]
connect_bd_intf_net [get_bd_intf_pins v_axi4s_vid_out_0/vtiming_in] [get_bd_intf_pins v_tc_0/vtiming_out]
connect_bd_net [get_bd_pins axi_dynclk_0/PXL_CLK_5X_O] [get_bd_pins rgb2dvi_0/SerialClk]
connect_bd_net [get_bd_pins axi_dynclk_0/PXL_CLK_O] \
  [get_bd_pins PIXEL_CLK_O] [get_bd_pins axi_vdma_0/m_axi_mm2s_aclk] [get_bd_pins axi_vdma_0/m_axis_mm2s_aclk] \
  [get_bd_pins rgb2dvi_0/PixelClk] [get_bd_pins v_axi4s_vid_out_0/aclk] [get_bd_pins v_tc_0/clk]
connect_bd_net -net mem_interface_ui_clk [get_bd_pins system_clk] \
  [get_bd_pins axi_dynclk_0/REF_CLK_I] [get_bd_pins axi_dynclk_0/s00_axi_aclk] [get_bd_pins axi_vdma_0/s_axi_lite_aclk] \
  [get_bd_pins v_tc_0/s_axi_aclk]
connect_bd_net -net proc_sys_reset_0_peripheral_aresetn [get_bd_pins s_axi_aresetn] \
  [get_bd_pins axi_dynclk_0/s00_axi_aresetn] [get_bd_pins axi_vdma_0/axi_resetn] [get_bd_pins v_axi4s_vid_out_0/aresetn] \
  [get_bd_pins v_tc_0/s_axi_aresetn]

current_bd_instance /
connect_bd_intf_net -intf_net S_AXI_LITE_2 [get_bd_intf_pins memory_subsystem/S_AXI_MEMORY_DMA] [get_bd_intf_pins system_intercon/M04_AXI]
connect_bd_intf_net -intf_net s00_axi_1 [get_bd_intf_pins system_intercon/M03_AXI] [get_bd_intf_pins video_subsystem/S_AXI_DYNCLK]
connect_bd_intf_net [get_bd_intf_pins memory_subsystem/S03_AXI] [get_bd_intf_pins system_intercon/M05_AXI]
connect_bd_intf_net -intf_net ethernet_subsystem_M00_AXI [get_bd_intf_pins ethernet_subsystem/M_AXI_ETH] [get_bd_intf_pins system_intercon/S01_AXI]
connect_bd_intf_net -intf_net axi_interconnect_0_M00_AXI [get_bd_intf_pins debug_subsystem/S_AXI_SYSTEM_DMA] [get_bd_intf_pins system_intercon/M00_AXI]
connect_bd_intf_net [get_bd_intf_pins graphics_subsystem/s_axi_lite2] [get_bd_intf_pins system_intercon/M08_AXI]
connect_bd_intf_net -intf_net axi_uartlite_0_UART [get_bd_intf_ports usb_uart] [get_bd_intf_pins debug_subsystem/usb_uart]
connect_bd_intf_net -intf_net mem_interface_DDR3 [get_bd_intf_ports DDR3] [get_bd_intf_pins memory_subsystem/DDR3]
connect_bd_intf_net [get_bd_intf_pins graphics_subsystem/renderOutput_dcache_0_M0_AXI] [get_bd_intf_pins memory_subsystem/S_AXI_GRAPHICS_CACHE]
connect_bd_intf_net -intf_net axis_udp_ethernet_0_RGMII_eth [get_bd_intf_ports RGMII_eth] [get_bd_intf_pins ethernet_subsystem/RGMII_eth]
connect_bd_intf_net -intf_net microblaze_0_M_AXI_DC [get_bd_intf_pins debug_subsystem/M_AXI_DC] [get_bd_intf_pins memory_subsystem/S00_AXI]
connect_bd_intf_net -intf_net ctrl_1 [get_bd_intf_pins system_intercon/M02_AXI] [get_bd_intf_pins video_subsystem/S_AXI_V_TC]
connect_bd_intf_net -intf_net S_AXI_LITE_1 [get_bd_intf_pins system_intercon/M01_AXI] [get_bd_intf_pins video_subsystem/S_AXI_VDMA]
connect_bd_intf_net [get_bd_intf_pins graphics_subsystem/s_axi_lite] [get_bd_intf_pins system_intercon/M11_AXI]
connect_bd_intf_net -intf_net microblaze_0_M_AXI_DP [get_bd_intf_pins debug_subsystem/M_AXI_DP] [get_bd_intf_pins system_intercon/S00_AXI]
connect_bd_intf_net [get_bd_intf_pins graphics_subsystem/S_AXI_FULL] [get_bd_intf_pins system_intercon/M10_AXI]
connect_bd_intf_net [get_bd_intf_pins graphics_subsystem/S_AXI] [get_bd_intf_pins system_intercon/M07_AXI]
connect_bd_intf_net -intf_net rgb2dvi_0_TMDS [get_bd_intf_ports TMDS_OUT] [get_bd_intf_pins video_subsystem/TMDS_OUT]
connect_bd_intf_net [get_bd_intf_pins graphics_subsystem/s_axi_lite1] [get_bd_intf_pins system_intercon/M09_AXI]
connect_bd_intf_net [get_bd_intf_pins graphics_subsystem/s_axi_lite3] [get_bd_intf_pins system_intercon/M12_AXI]
connect_bd_intf_net -intf_net video_subsystem_M_AXI_MM2S [get_bd_intf_pins memory_subsystem/S01_AXI] [get_bd_intf_pins video_subsystem/M_AXI_VDMA_MM2S]
connect_bd_net -net ARESETN_1 [get_bd_pins debug_subsystem/interconnect_aresetn] \
  [get_bd_pins ethernet_subsystem/s_axis_aresetn] [get_bd_pins graphics_subsystem/s_axis_aresetn] \
  [get_bd_pins memory_subsystem/aresetn] [get_bd_pins system_intercon/ARESETN]
connect_bd_net -net mem_interface_mmcm_locked [get_bd_pins memory_subsystem/mmcm_locked] [get_bd_pins debug_subsystem/dcm_locked]
connect_bd_net -net mem_interface_ui_clk [get_bd_pins memory_subsystem/system_clk] \
  [get_bd_pins debug_subsystem/system_clk] [get_bd_pins ethernet_subsystem/clk] [get_bd_pins graphics_subsystem/s_axis_aclk] \
  [get_bd_pins system_intercon/ACLK] [get_bd_pins video_subsystem/system_clk]
connect_bd_net -net mem_interface_ui_clk_sync_rst [get_bd_pins memory_subsystem/ui_clk_sync_rst] [get_bd_pins debug_subsystem/ext_reset_in]
connect_bd_net -net proc_sys_reset_0_peripheral_aresetn [get_bd_pins debug_subsystem/system_aresetn] \
  [get_bd_pins ethernet_subsystem/reset_n] [get_bd_pins memory_subsystem/s_axi_lite_aresetn] \
  [get_bd_pins video_subsystem/s_axi_aresetn]
connect_bd_net [get_bd_ports reset] [get_bd_pins memory_subsystem/reset]
connect_bd_net [get_bd_ports sys_clk_i] [get_bd_pins memory_subsystem/sys_clk_i]
connect_bd_net -net video_subsystem_VDMA_CLK_O [get_bd_pins video_subsystem/PIXEL_CLK_O] [get_bd_pins memory_subsystem/PIXEL_CLK_I]

# ---- address map ----
assign_bd_address -offset 0x00000000 -range 32K -target_address_space [get_bd_addr_spaces debug_subsystem/microblaze_0/Data] [get_bd_addr_segs debug_subsystem/microblaze_0_local_memory/dlmb_bram_if_cntrl_0/SLMB/Mem]
assign_bd_address -offset 0x40600000 -range 64K -target_address_space [get_bd_addr_spaces debug_subsystem/microblaze_0/Data] [get_bd_addr_segs debug_subsystem/axi_uartlite_0/S_AXI/Reg]
assign_bd_address -offset 0x44A00000 -range 64K -target_address_space [get_bd_addr_spaces debug_subsystem/microblaze_0/Data] [get_bd_addr_segs video_subsystem/axi_vdma_0/S_AXI_LITE/Reg]
assign_bd_address -offset 0x44A10000 -range 64K -target_address_space [get_bd_addr_spaces debug_subsystem/microblaze_0/Data] [get_bd_addr_segs video_subsystem/v_tc_0/ctrl/Reg]
assign_bd_address -offset 0x44A20000 -range 64K -target_address_space [get_bd_addr_spaces debug_subsystem/microblaze_0/Data] [get_bd_addr_segs video_subsystem/axi_dynclk_0/s00_axi/reg0]
assign_bd_address -offset 0x44A30000 -range 64K -target_address_space [get_bd_addr_spaces debug_subsystem/microblaze_0/Data] [get_bd_addr_segs memory_subsystem/memory_dma/S_AXI_LITE/Reg]
assign_bd_address -offset 0x44A40000 -range 64K -target_address_space [get_bd_addr_spaces debug_subsystem/microblaze_0/Data] [get_bd_addr_segs system_intercon/system_dma/S_AXI_LITE/Reg]
assign_bd_address -offset 0x44A50000 -range 64K -target_address_space [get_bd_addr_spaces debug_subsystem/microblaze_0/Data] [get_bd_addr_segs graphics_subsystem/sgp_vertexFetch/vertex_buffer_FIFO/S_AXI/Mem0]
assign_bd_address -offset 0x44A60000 -range 64K -target_address_space [get_bd_addr_spaces debug_subsystem/microblaze_0/Data] [get_bd_addr_segs graphics_subsystem/sgp_vertexFetch/vertex_buffer_FIFO/S_AXI_FULL/Mem1]
assign_bd_address -offset 0x44A70000 -range 64K -target_address_space [get_bd_addr_spaces debug_subsystem/microblaze_0/Data] [get_bd_addr_segs graphics_subsystem/sgp_vertexFetch/vertexFetch_core_0/s_axi_lite/reg0]
assign_bd_address -offset 0x44A80000 -range 64K -target_address_space [get_bd_addr_spaces debug_subsystem/microblaze_0/Data] [get_bd_addr_segs graphics_subsystem/sgp_viewPort/s_axi_lite/reg0]
assign_bd_address -offset 0x44A90000 -range 64K -target_address_space [get_bd_addr_spaces debug_subsystem/microblaze_0/Data] [get_bd_addr_segs graphics_subsystem/sgp_renderOutput/s_axi_lite/reg0]
assign_bd_address -offset 0x80000000 -range 512M -target_address_space [get_bd_addr_spaces debug_subsystem/microblaze_0/Data] [get_bd_addr_segs memory_subsystem/mem_interface/memmap/memaddr]
assign_bd_address -offset 0x00000000 -range 32K -target_address_space [get_bd_addr_spaces debug_subsystem/microblaze_0/Instruction] [get_bd_addr_segs debug_subsystem/microblaze_0_local_memory/ilmb_bram_if_cntrl_0/SLMB/Mem]
assign_bd_address -offset 0x40600000 -range 64K -target_address_space [get_bd_addr_spaces ethernet_subsystem/axi_mm2s_mapper_0/Bridge] [get_bd_addr_segs debug_subsystem/axi_uartlite_0/S_AXI/Reg]
assign_bd_address -offset 0x44A00000 -range 64K -target_address_space [get_bd_addr_spaces ethernet_subsystem/axi_mm2s_mapper_0/Bridge] [get_bd_addr_segs video_subsystem/axi_vdma_0/S_AXI_LITE/Reg]
assign_bd_address -offset 0x44A10000 -range 64K -target_address_space [get_bd_addr_spaces ethernet_subsystem/axi_mm2s_mapper_0/Bridge] [get_bd_addr_segs video_subsystem/v_tc_0/ctrl/Reg]
assign_bd_address -offset 0x44A20000 -range 64K -target_address_space [get_bd_addr_spaces ethernet_subsystem/axi_mm2s_mapper_0/Bridge] [get_bd_addr_segs video_subsystem/axi_dynclk_0/s00_axi/reg0]
assign_bd_address -offset 0x44A30000 -range 64K -target_address_space [get_bd_addr_spaces ethernet_subsystem/axi_mm2s_mapper_0/Bridge] [get_bd_addr_segs memory_subsystem/memory_dma/S_AXI_LITE/Reg]
assign_bd_address -offset 0x44A40000 -range 64K -target_address_space [get_bd_addr_spaces ethernet_subsystem/axi_mm2s_mapper_0/Bridge] [get_bd_addr_segs system_intercon/system_dma/S_AXI_LITE/Reg]
assign_bd_address -offset 0x44A50000 -range 64K -target_address_space [get_bd_addr_spaces ethernet_subsystem/axi_mm2s_mapper_0/Bridge] [get_bd_addr_segs graphics_subsystem/sgp_vertexFetch/vertex_buffer_FIFO/S_AXI/Mem0]
assign_bd_address -offset 0x44A60000 -range 64K -target_address_space [get_bd_addr_spaces ethernet_subsystem/axi_mm2s_mapper_0/Bridge] [get_bd_addr_segs graphics_subsystem/sgp_vertexFetch/vertex_buffer_FIFO/S_AXI_FULL/Mem1]
assign_bd_address -offset 0x44A70000 -range 64K -target_address_space [get_bd_addr_spaces ethernet_subsystem/axi_mm2s_mapper_0/Bridge] [get_bd_addr_segs graphics_subsystem/sgp_vertexFetch/vertexFetch_core_0/s_axi_lite/reg0]
assign_bd_address -offset 0x44A80000 -range 64K -target_address_space [get_bd_addr_spaces ethernet_subsystem/axi_mm2s_mapper_0/Bridge] [get_bd_addr_segs graphics_subsystem/sgp_viewPort/s_axi_lite/reg0]
assign_bd_address -offset 0x44A90000 -range 64K -target_address_space [get_bd_addr_spaces ethernet_subsystem/axi_mm2s_mapper_0/Bridge] [get_bd_addr_segs graphics_subsystem/sgp_renderOutput/s_axi_lite/reg0]
assign_bd_address -offset 0x80000000 -range 512M -target_address_space [get_bd_addr_spaces ethernet_subsystem/axi_mm2s_mapper_0/Bridge] [get_bd_addr_segs memory_subsystem/mem_interface/memmap/memaddr]
assign_bd_address -offset 0x80000000 -range 512M -target_address_space [get_bd_addr_spaces graphics_subsystem/sgp_renderOutput/m_axi] [get_bd_addr_segs memory_subsystem/mem_interface/memmap/memaddr]
assign_bd_address -offset 0x80000000 -range 512M -target_address_space [get_bd_addr_spaces memory_subsystem/memory_dma/Data] [get_bd_addr_segs memory_subsystem/mem_interface/memmap/memaddr]
assign_bd_address -offset 0x40600000 -range 64K -target_address_space [get_bd_addr_spaces system_intercon/system_dma/Data] [get_bd_addr_segs debug_subsystem/axi_uartlite_0/S_AXI/Reg]
assign_bd_address -offset 0x44A00000 -range 64K -target_address_space [get_bd_addr_spaces system_intercon/system_dma/Data] [get_bd_addr_segs video_subsystem/axi_vdma_0/S_AXI_LITE/Reg]
assign_bd_address -offset 0x44A10000 -range 64K -target_address_space [get_bd_addr_spaces system_intercon/system_dma/Data] [get_bd_addr_segs video_subsystem/v_tc_0/ctrl/Reg]
assign_bd_address -offset 0x44A20000 -range 64K -target_address_space [get_bd_addr_spaces system_intercon/system_dma/Data] [get_bd_addr_segs video_subsystem/axi_dynclk_0/s00_axi/reg0]
assign_bd_address -offset 0x44A30000 -range 64K -target_address_space [get_bd_addr_spaces system_intercon/system_dma/Data] [get_bd_addr_segs memory_subsystem/memory_dma/S_AXI_LITE/Reg]
assign_bd_address -offset 0x44A40000 -range 64K -target_address_space [get_bd_addr_spaces system_intercon/system_dma/Data] [get_bd_addr_segs system_intercon/system_dma/S_AXI_LITE/Reg]
assign_bd_address -offset 0x44A50000 -range 64K -target_address_space [get_bd_addr_spaces system_intercon/system_dma/Data] [get_bd_addr_segs graphics_subsystem/sgp_vertexFetch/vertex_buffer_FIFO/S_AXI/Mem0]
assign_bd_address -offset 0x44A60000 -range 64K -target_address_space [get_bd_addr_spaces system_intercon/system_dma/Data] [get_bd_addr_segs graphics_subsystem/sgp_vertexFetch/vertex_buffer_FIFO/S_AXI_FULL/Mem1]
assign_bd_address -offset 0x44A70000 -range 64K -target_address_space [get_bd_addr_spaces system_intercon/system_dma/Data] [get_bd_addr_segs graphics_subsystem/sgp_vertexFetch/vertexFetch_core_0/s_axi_lite/reg0]
assign_bd_address -offset 0x44A80000 -range 64K -target_address_space [get_bd_addr_spaces system_intercon/system_dma/Data] [get_bd_addr_segs graphics_subsystem/sgp_viewPort/s_axi_lite/reg0]
assign_bd_address -offset 0x44A90000 -range 64K -target_address_space [get_bd_addr_spaces system_intercon/system_dma/Data] [get_bd_addr_segs graphics_subsystem/sgp_renderOutput/s_axi_lite/reg0]
assign_bd_address -offset 0x80000000 -range 512M -target_address_space [get_bd_addr_spaces system_intercon/system_dma/Data] [get_bd_addr_segs memory_subsystem/mem_interface/memmap/memaddr]
assign_bd_address -offset 0x80000000 -range 512M -target_address_space [get_bd_addr_spaces video_subsystem/axi_vdma_0/Data_MM2S] [get_bd_addr_segs memory_subsystem/mem_interface/memmap/memaddr]

validate_bd_design
save_bd_design
